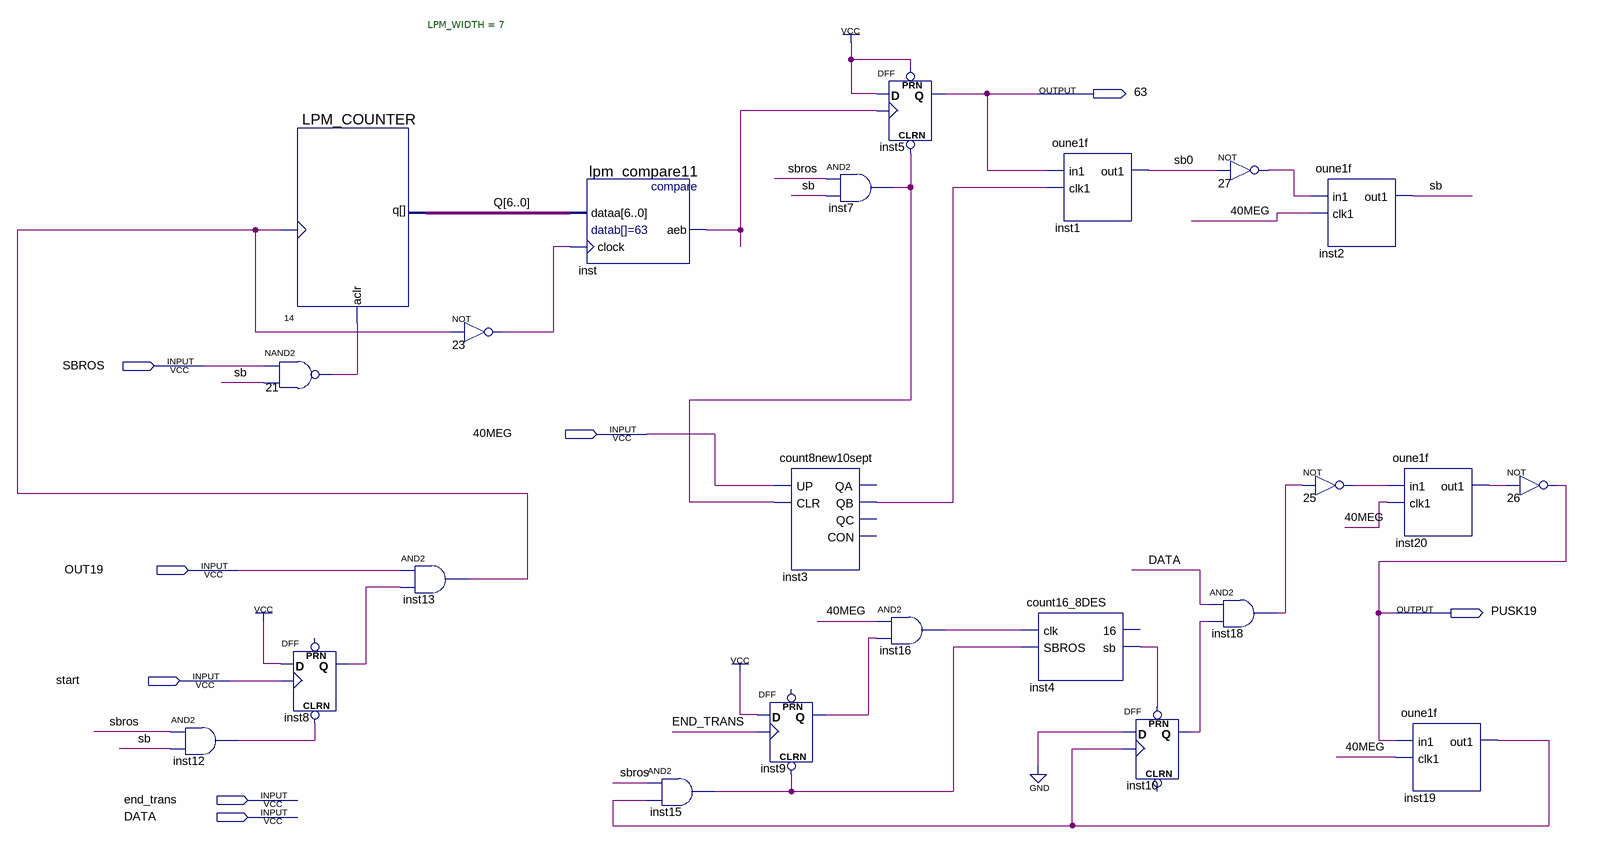
[diagram p0: schematic sheet]
// Quartus schematic count65.bdf as structural Verilog: 23 symbols, 8 pins
module count65 (
  input  SBROS,
  input  \40MEG ,
  input  OUT19,
  input  start,
  input  end_trans,
  input  DATA,
  output \63 ,
  output PUSK19
);

  wire inst3_qb, inst4_sb, inst7_out, inst8_q, inst9_q, inst10_q, inst12_out, inst13_out, inst15_out,
       inst16_out, inst18_out, inst19_out1, inst20_out1, inst_aeb, n21_out, n23_out, n25_out, n27_out, sb,
       sb0;
  wire [6:0] Q;

  and inst12 (inst12_out, SBROS, sb);
  LPM_COUNTER #(.LPM_WIDTH(7)) u_14 (.clock(inst13_out), .aclr(n21_out), .q(Q));
  nand u_21 (n21_out, SBROS, sb);
  DFF inst8 (.CLRN(inst12_out), .CLK(start), .D(1'b1), .Q(inst8_q));  // open: PRN
  and inst13 (inst13_out, OUT19, inst8_q);
  not u_23 (n23_out, inst13_out);
  lpm_compare11 inst (.dataa(Q), .clock(n23_out), .aeb(inst_aeb));
  and inst15 (inst15_out, SBROS, inst19_out1);
  count8new10sept inst3 (.UP(\40MEG ), .CLR(inst7_out), .QB(inst3_qb));  // open: QA, QC, CON
  DFF inst9 (.CLRN(inst15_out), .CLK(end_trans), .D(1'b1), .Q(inst9_q));  // open: PRN
  and inst7 (inst7_out, SBROS, sb);
  DFF inst5 (.CLRN(inst7_out), .CLK(inst_aeb), .D(1'b1), .PRN(1'b1), .Q(\63 ));
  and inst16 (inst16_out, \40MEG , inst9_q);
  oune1f inst1 (.in1(\63 ), .clk1(inst3_qb), .out1(sb0));
  count16_8DES inst4 (.clk(inst16_out), .SBROS(inst15_out), .sb(inst4_sb));  // open: 16
  DFF inst10 (.CLK(inst19_out1), .D(1'b0), .PRN(inst4_sb), .Q(inst10_q));  // open: CLRN
  not u_27 (n27_out, sb0);
  and inst18 (inst18_out, DATA, inst10_q);
  oune1f inst2 (.in1(n27_out), .clk1(\40MEG ), .out1(sb));
  not u_25 (n25_out, inst18_out);
  oune1f inst20 (.in1(n25_out), .clk1(\40MEG ), .out1(inst20_out1));
  oune1f inst19 (.in1(PUSK19), .clk1(\40MEG ), .out1(inst19_out1));
  not u_26 (PUSK19, inst20_out1);
endmodule
